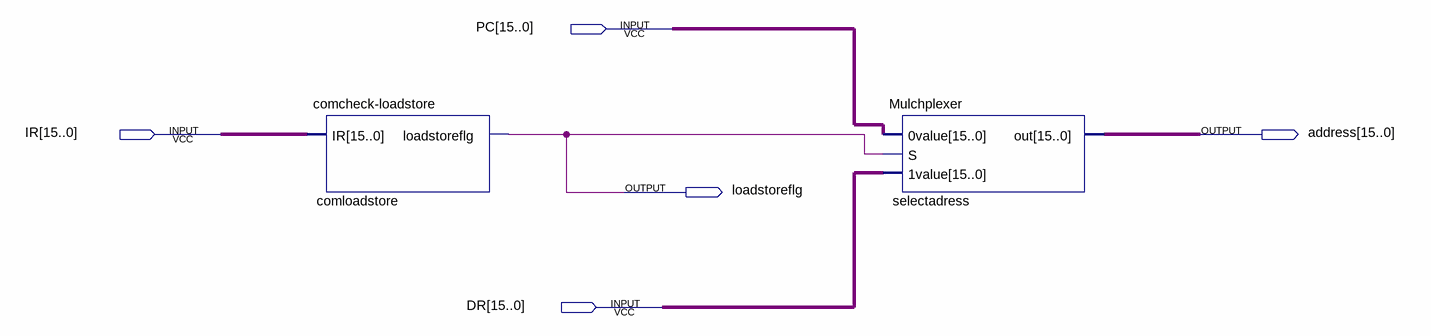
[diagram p0: schematic sheet]
// Quartus schematic address-selector.bdf as structural Verilog: 2 symbols, 5 pins
module \address-selector  (
  input  [15:0] PC,
  input  [15:0] IR,
  input  [15:0] DR,
  output [15:0] address,
  output loadstoreflg
);

  \comcheck-loadstore  comloadstore (.IR(IR), .loadstoreflg(loadstoreflg));
  Mulchplexer selectadress (.\0value (PC), .S(loadstoreflg), .\1value (DR), .out(address));
endmodule
